# Altium project PCB_Project_3.PrjPcb
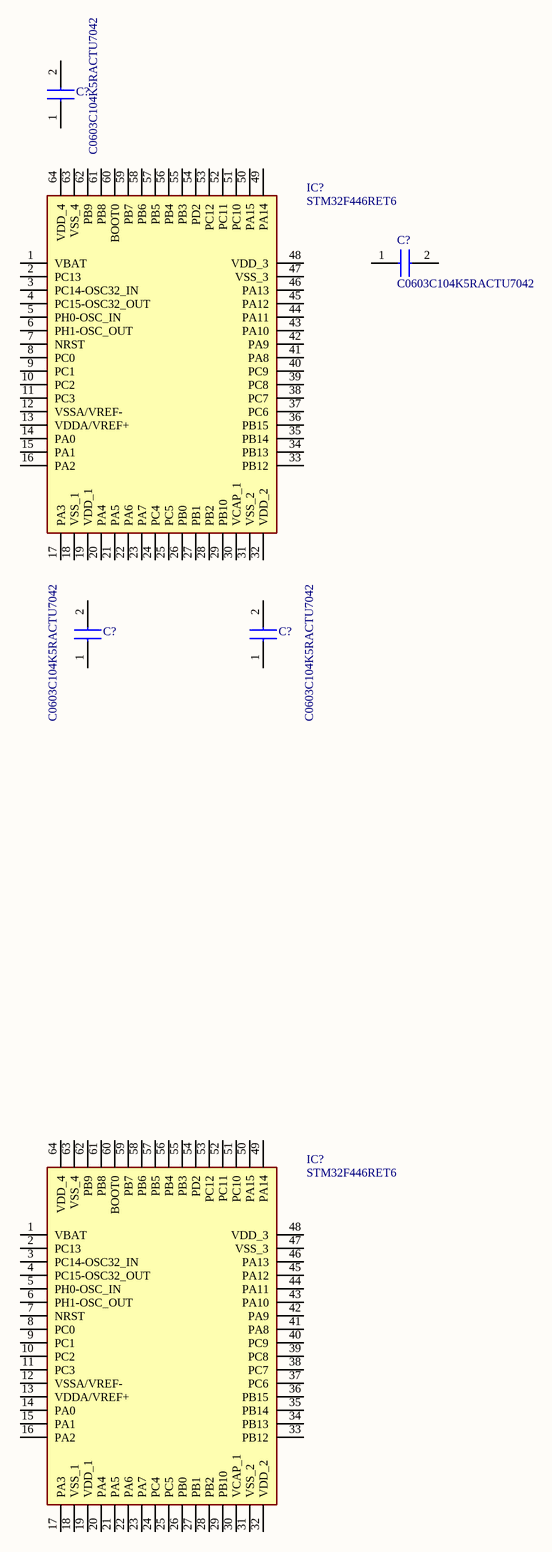
[diagram p0: Microcontrollers.SchDoc]
3 sheets, 6 parts. Net scope: global (net labels, ports and power ports of the same name join across sheets).
Board file: PCB2.PcbDoc
Sheets:
  Microcontrollers.SchDoc
  Power_and_Main_Comm.SchDoc
  Isolated_CAN_Interfaces.SchDoc

## Sheet Microcontrollers.SchDoc
size C; SheetNumber: 1; SheetTotal: 3

### Parts
(Parts that share a designator on the sheet are numbered #1, #2 ... from top to bottom, then left to right.)
C?#1  C0603C104K5RACTU7042  [CAPC1608X95N]
C?#2  C0603C104K5RACTU7042  [CAPC1608X95N]
C?#3  C0603C104K5RACTU7042  [CAPC1608X95N]
C?#4  C0603C104K5RACTU7042  [CAPC1608X95N]
IC?#1  STM32F446RET6  [QFP50P1200X1200X160-64N]
IC?#2  STM32F446RET6  [QFP50P1200X1200X160-64N]

### Nets

Not connected (* = marked no-connect by the designer): C?#1 1 2; C?#2 1 2; C?#3 1 2; C?#4 1 2; IC?#1 1(VBAT) 2(PC13) 3(PC14-OSC32_IN) 4(PC15-OSC32_OUT) 5(PH0-OSC_IN) 6(PH1-OSC_OUT) 7(NRST) 8(PC0) 9(PC1) 10(PC2) 11(PC3) 12(VSSA/VREF-) 13(VDDA/VREF+) 14(PA0) 15(PA1) 16(PA2) 17(PA3) 18(VSS_1) 19(VDD_1) 20(PA4) 21(PA5) 22(PA6) 23(PA7) 24(PC4) 25(PC5) 26(PB0) 27(PB1) 28(PB2) 29(PB10) 30(VCAP_1) 31(VSS_2) 32(VDD_2) 33(PB12) 34(PB13) 35(PB14) 36(PB15) 37(PC6) 38(PC7) 39(PC8) 40(PC9) 41(PA8) 42(PA9) 43(PA10) 44(PA11) 45(PA12) 46(PA13) 47(VSS_3) 48(VDD_3) 49(PA14) 50(PA15) 51(PC10) 52(PC11) 53(PC12) 54(PD2) 55(PB3) 56(PB4) 57(PB5) 58(PB6) 59(PB7) 60(BOOT0) 61(PB8) 62(PB9) 63(VSS_4) 64(VDD_4); IC?#2 1(VBAT) 2(PC13) 3(PC14-OSC32_IN) 4(PC15-OSC32_OUT) 5(PH0-OSC_IN) 6(PH1-OSC_OUT) 7(NRST) 8(PC0) 9(PC1) 10(PC2) 11(PC3) 12(VSSA/VREF-) 13(VDDA/VREF+) 14(PA0) 15(PA1) 16(PA2) 17(PA3) 18(VSS_1) 19(VDD_1) 20(PA4) 21(PA5) 22(PA6) 23(PA7) 24(PC4) 25(PC5) 26(PB0) 27(PB1) 28(PB2) 29(PB10) 30(VCAP_1) 31(VSS_2) 32(VDD_2) 33(PB12) 34(PB13) 35(PB14) 36(PB15) 37(PC6) 38(PC7) 39(PC8) 40(PC9) 41(PA8) 42(PA9) 43(PA10) 44(PA11) 45(PA12) 46(PA13) 47(VSS_3) 48(VDD_3) 49(PA14) 50(PA15) 51(PC10) 52(PC11) 53(PC12) 54(PD2) 55(PB3) 56(PB4) 57(PB5) 58(PB6) 59(PB7) 60(BOOT0) 61(PB8) 62(PB9) 63(VSS_4) 64(VDD_4)

### Library data of the parts
C?#1-C?#4 = C0603C104K5RACTU7042: Capacitor; Manufacturer_Name: KEMET; Datasheet Link: https://www.arrow.com/en/products/c0603c104k5ractu7042/kemet-corporation; Height: 0.95mm; Manufacturer_Part_Number: C0603C104K5RACTU7042; Arrow Part Number: C0603C104K5RACTU7042; Arrow Price/Stock: https://www.arrow.com/en/products/c0603c104k5ractu7042/kemet-corporation
IC?#1 IC?#2 = STM32F446RET6: Integrated Circuit; Manufacturer_Name: STMicroelectronics; Datasheet Link: https://datasheet.datasheetarchive.com/originals/distributors/DKDS41/DSANUWW0028583.pdf; Height: 1.6mm; Manufacturer_Part_Number: STM32F446RET6; Mouser Part Number: 511-STM32F446RET6; Mouser Price/Stock: https://www.mouser.co.uk/ProductDetail/STMicroelectronics/STM32F446RET6?qs=Ok1pvOkw6%2FqpQsWf8F4wtQ%3D%3D; Arrow Part Number: STM32F446RET6; Arrow Price/Stock: https://www.arrow.com/en/products/stm32f446ret6/stmicroelectronics?utm_currency=USD&region=nac

## Sheet Power_and_Main_Comm.SchDoc
size A; SheetNumber: 2; SheetTotal: 2
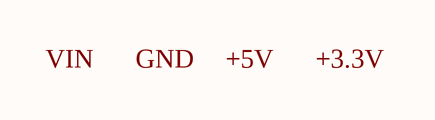
[diagram p1: Power_and_Main_Comm.SchDoc]

### Notes on the sheet
- Labels drawn without touching a wire or pin: +3.3V, +5V, GND, VIN

## Sheet Isolated_CAN_Interfaces.SchDoc
size A; SheetNumber: 3; SheetTotal: 3